# EAGLE design 9volt_rail (EAGLE 7.1.0)
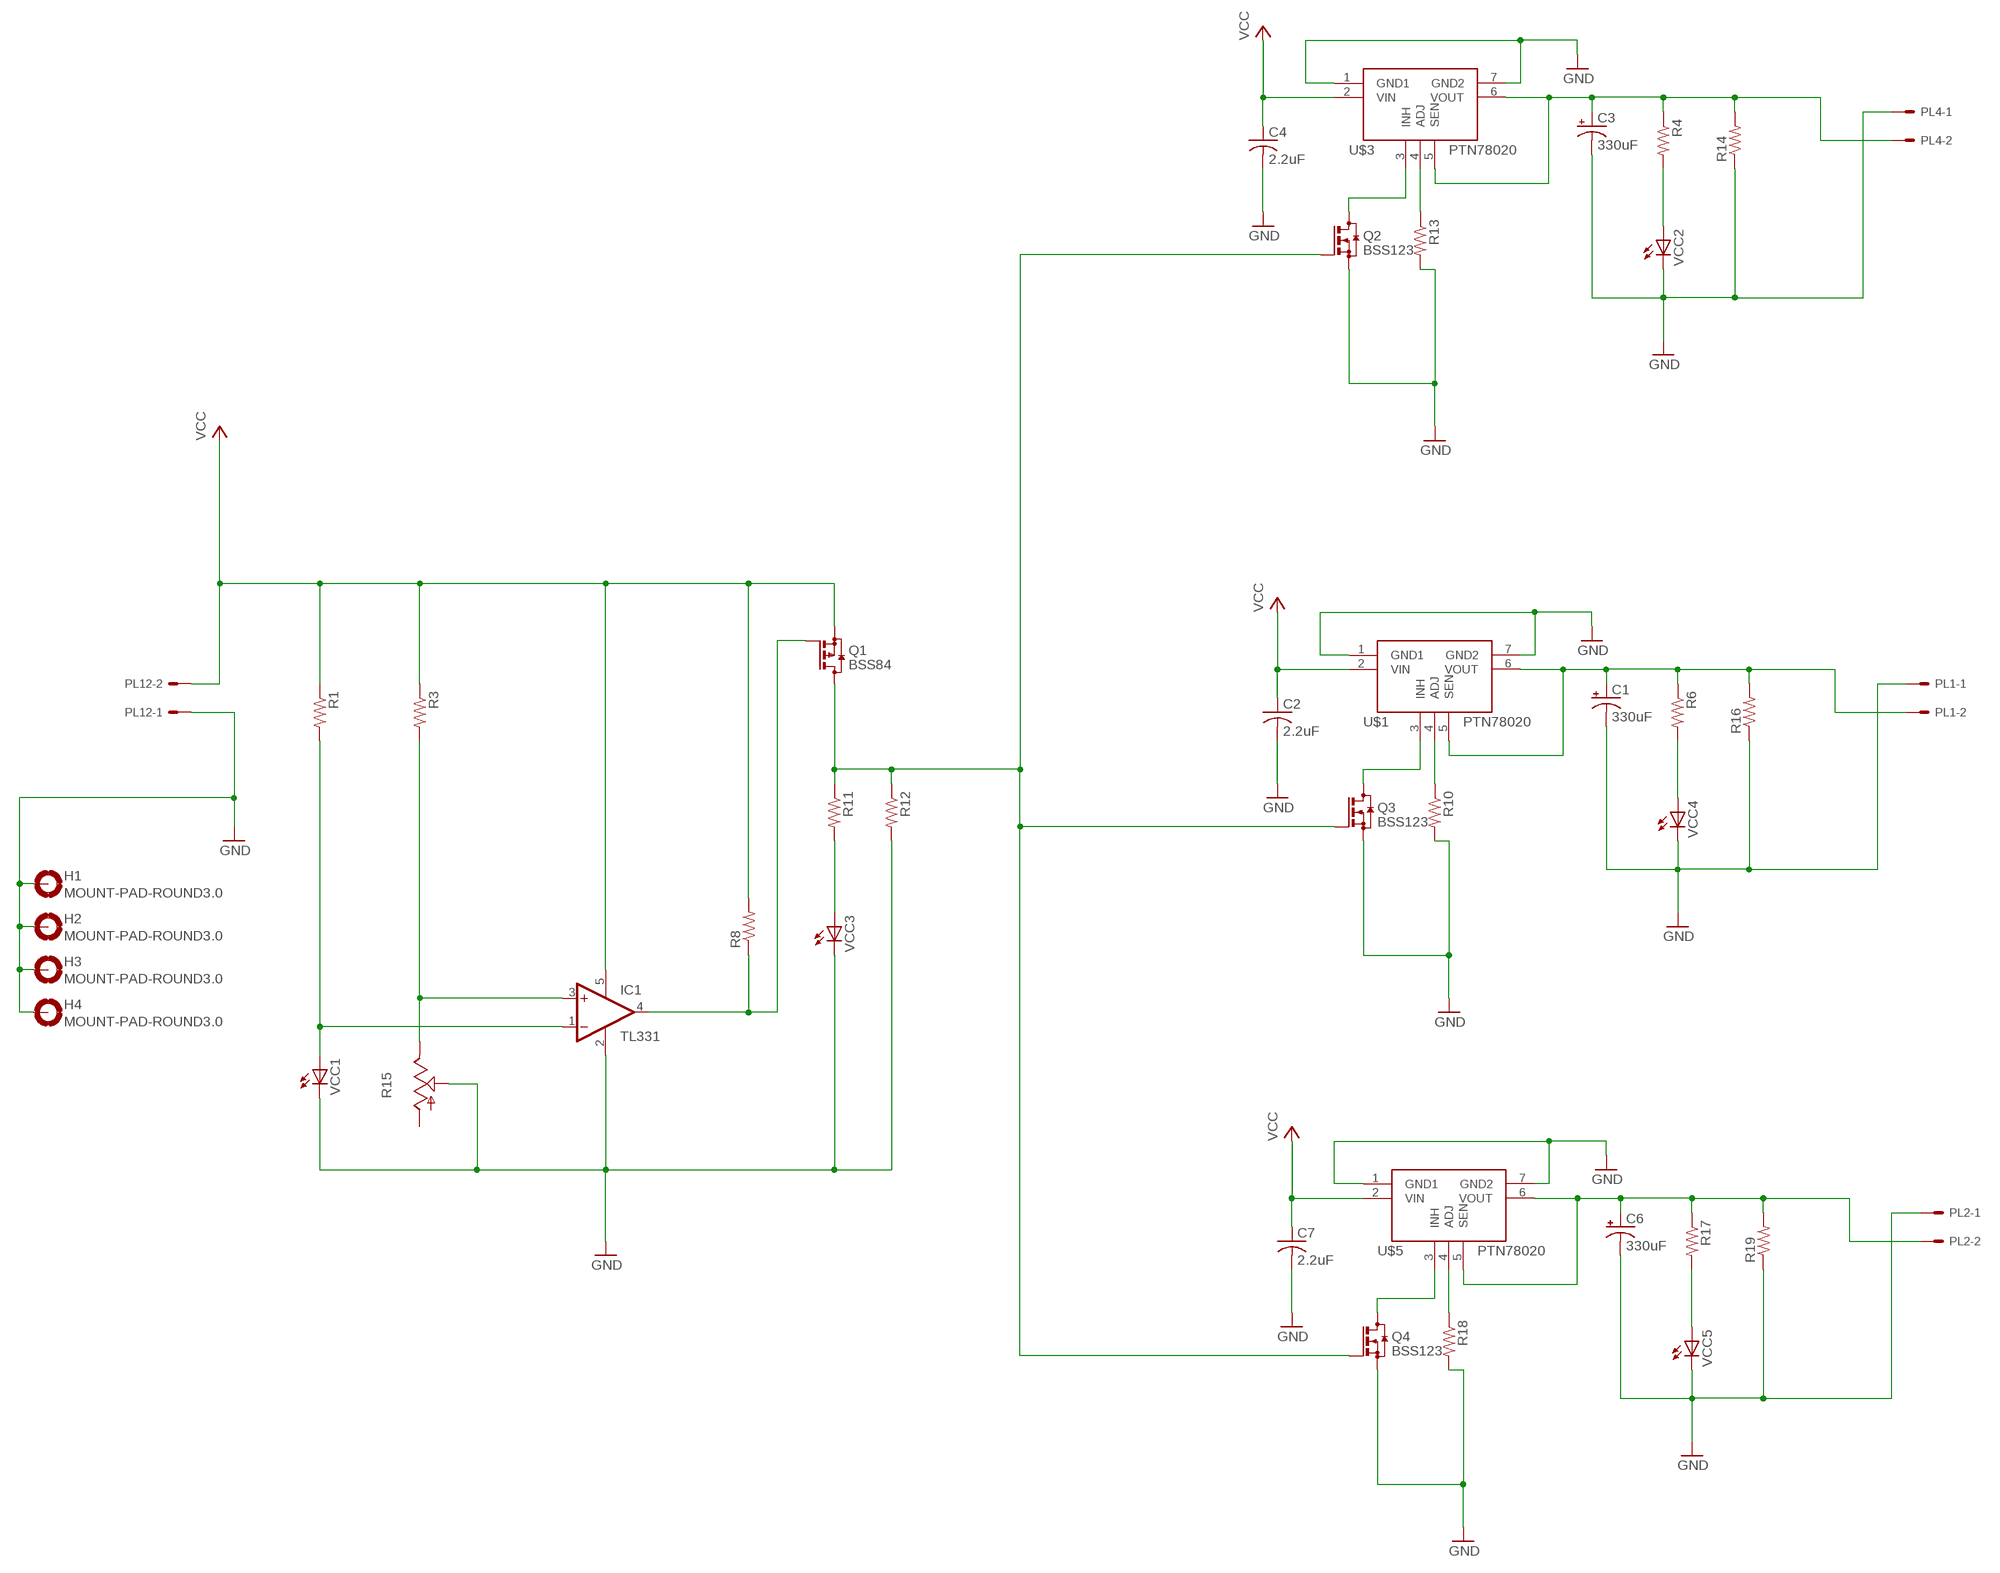
[diagram p0: schematic, sheet 1]

## Parts
C1  330uF  CPOL-USE5-10.5  [E5-10,5]
C2  2.2uF  C-USC0805  [C0805]
C3  330uF  CPOL-USE5-10.5  [E5-10,5]
C4  2.2uF  C-USC0805  [C0805]
C6  330uF  CPOL-USE5-10.5  [E5-10,5]
C7  2.2uF  C-USC0805  [C0805]
H1  MOUNT-PAD-ROUND3.0  [3,0-PAD]
H2  MOUNT-PAD-ROUND3.0  [3,0-PAD]
H3  MOUNT-PAD-ROUND3.0  [3,0-PAD]
H4  MOUNT-PAD-ROUND3.0  [3,0-PAD]
IC1  TL331  [DBV-R-PDSO-G5]
PL1  555X-2H  [5569-2]
PL2  555X-2H  [5569-2]
PL4  555X-2H  [5569-2]
PL12  555X-2H  [5569-2]
Q1  BSS84  [SOT23]
Q2  BSS123  [SOT23]
Q3  BSS123  [SOT23]
Q4  BSS123  [SOT23]
R1  R-US_M0805  [M0805]
R3  R-US_M0805  [M0805]
R4  R-US_M0805  [M0805]
R6  R-US_M0805  [M0805]
R8  R-US_M0805  [M0805]
R10  R-US_M0805  [M0805]
R11  R-US_M0805  [M0805]
R12  R-US_M0805  [M0805]
R13  R-US_M0805  [M0805]
R14  R-US_0617/17  [0617/17]
R15  TRIM_US-S63P  [S63P]
R16  R-US_0617/17  [0617/17]
R17  R-US_M0805  [M0805]
R18  R-US_M0805  [M0805]
R19  R-US_0617/17  [0617/17]
U$1  PTH78020-SMD  [PTN78020-SND]
U$3  PTH78020-SMD  [PTN78020-SND]
U$5  PTH78020-SMD  [PTN78020-SND]
VCC1  LED5MM  [LED5MM]
VCC2  LED5MM  [LED5MM]
VCC3  LED5MM  [LED5MM]
VCC4  LED5MM  [LED5MM]
VCC5  LED5MM  [LED5MM]

## Nets
GND: C1.- C2.2 C3.- C4.2 C6.- C7.2 H1.B3,0(MOUNT) H2.B3,0(MOUNT) H3.B3,0(MOUNT) H4.B3,0(MOUNT) IC1.2(GND) PL1.1 PL2.1 PL4.1 PL12.1 Q2.2(S) Q3.2(S) Q4.2(S) R10.2 R12.2 R13.2 R14.1 R15.S R16.1 R18.2 R19.1 U$1.1(GND1) U$1.7(GND2) U$3.1(GND1) U$3.7(GND2) U$5.1(GND1) U$5.7(GND2) VCC1.K(C) VCC2.K(C) VCC3.K(C) VCC4.K(C) VCC5.K(C)
N$2: IC1.4(OUT) Q1.1(G) R8.1
N$4: IC1.3(+IN) R3.2 R15.E
N$7: IC1.1(-IN) R1.2 VCC1.A
N$8: R11.2 VCC3.A
N$9: R4.2 VCC2.A
N$10: Q2.3(D) U$3.3(INH)
N$11: C3.+ PL4.2 R4.1 R14.2 U$3.5(SEN) U$3.6(VOUT)
N$13: R13.1 U$3.4(ADJ)
N$14: R6.2 VCC4.A
N$15: C1.+ PL1.2 R6.1 R16.2 U$1.5(SEN) U$1.6(VOUT)
N$16: R10.1 U$1.4(ADJ)
N$18: Q3.3(D) U$1.3(INH)
N$19: R17.2 VCC5.A
N$20: C6.+ PL2.2 R17.1 R19.2 U$5.5(SEN) U$5.6(VOUT)
N$21: R18.1 U$5.4(ADJ)
N$23: Q4.3(D) U$5.3(INH)
N$24: Q1.3(D) Q2.1(G) Q3.1(G) Q4.1(G) R11.1 R12.1
VCC: C2.1 C4.1 C7.1 IC1.5(V+) PL12.2 Q1.2(S) R1.1 R3.1 R8.2 U$1.2(VIN) U$3.2(VIN) U$5.2(VIN)
Unconnected: R15.A

## Library data of the parts
C1 C3 C6 = rcl:CPOL-US: POLARIZED CAPACITOR, American symbol
C2 C4 C7 = adafruit:C-US: CAPACITOR, American symbol
H1-H4 = holes:MOUNT-PAD-ROUND: MOUNTING PAD, round
IC1 = linear:TL331: SINGLE DIFFERENTIAL COMPARATOR Source: Data sheet <http://www.ti.com/lit/ds/symlink/tl331-q1.pdf>
PL1 PL2 PL4 PL12 = con-molex-2:555X-2: Mini FIT connector 2 way
Q1 = transistor-small-signal:BSS84: P-CHANNEL MOS FET
Q2-Q4 = transistor-small-signal:BSS123: N-CHANNEL MOS FET
R1 R3 R4 R6 R8 R10-R13 R17 R18 = adafruit:R-US_: RESISTOR, American symbol
R14 R16 R19 = resistor:R-US_: RESISTOR, American symbol
R15 = pot:TRIM_US-: POTENTIOMETER
U$1 U$3 U$5 = PTN78020:PTH78020-SMD
VCC1-VCC5 = adafruit:LED: LED OSRAM: - CHIPLED LG R971, LG N971, LY N971, LG Q971, LY Q971, LO R971, LY R971 LH N974, LH R974 LS Q976, LO Q976, LY Q976 LO Q996 - Hyper CHIPLED LW Q18S LB Q993, LB Q99A, LB R99A - SideLED LS A670, LO A670, LY A670, LG A670, LP A670 LB A673, LV A673, LT A673, LW A673 LH A674 LY A675 LS A676, LA A676, LO A676, LY A676, LW A676 LS A679, LY A679, LG A679 - Hyper Micro SIDELED® LS Y876, LA Y876, LO Y876, LY Y876 LT Y87S - SmartLED LW L88C, LW L88S LB L89C, LB L89S, LG L890 LS L89K, LO L89K, LY L89K LS L896, LA L896, LO L896, LY L896 - TOPLED LS T670, LO T670, LY T670, LG T670, LP T670 LSG T670, LSP T670, LSY T670, LOP T670, LYG T670 LG T671, LOG T671, LSG T671 LB T673, LV T673, LT T673, LW T673 LH T674 LS T676, LA T676, LO T676, LY T676, LB T676, LH T676, LSB T676, LW T676 LB T67C, LV T67C, LT T67C, LS T67K, LO T67K, LY T67K, LW E67C LS E67B, LA E67B, LO E67B, LY E67B, LB E67C, LV E67C, LT E67C LW T67C LS T679, LY T679, LG T679 LS T770, LO T770, LY T770, LG T770, LP T770 LB T773, LV T773, LT T773, LW T773 LH T774 LS E675, LA E675, LY E675, LS T675 LS T776, LA T776, LO T776, LY T776, LB T776 LHGB T686 LT T68C, LB T68C - Hyper Mini TOPLED® LB M676 - Mini TOPLED Santana® LG M470 LS M47K, LO M47K, LY M47K Source: http://www.osram.convergy.de/

## Net classes
0 default: width 0.203 mm, drill 0.508 mm, clearance 0.254 mm

## Board
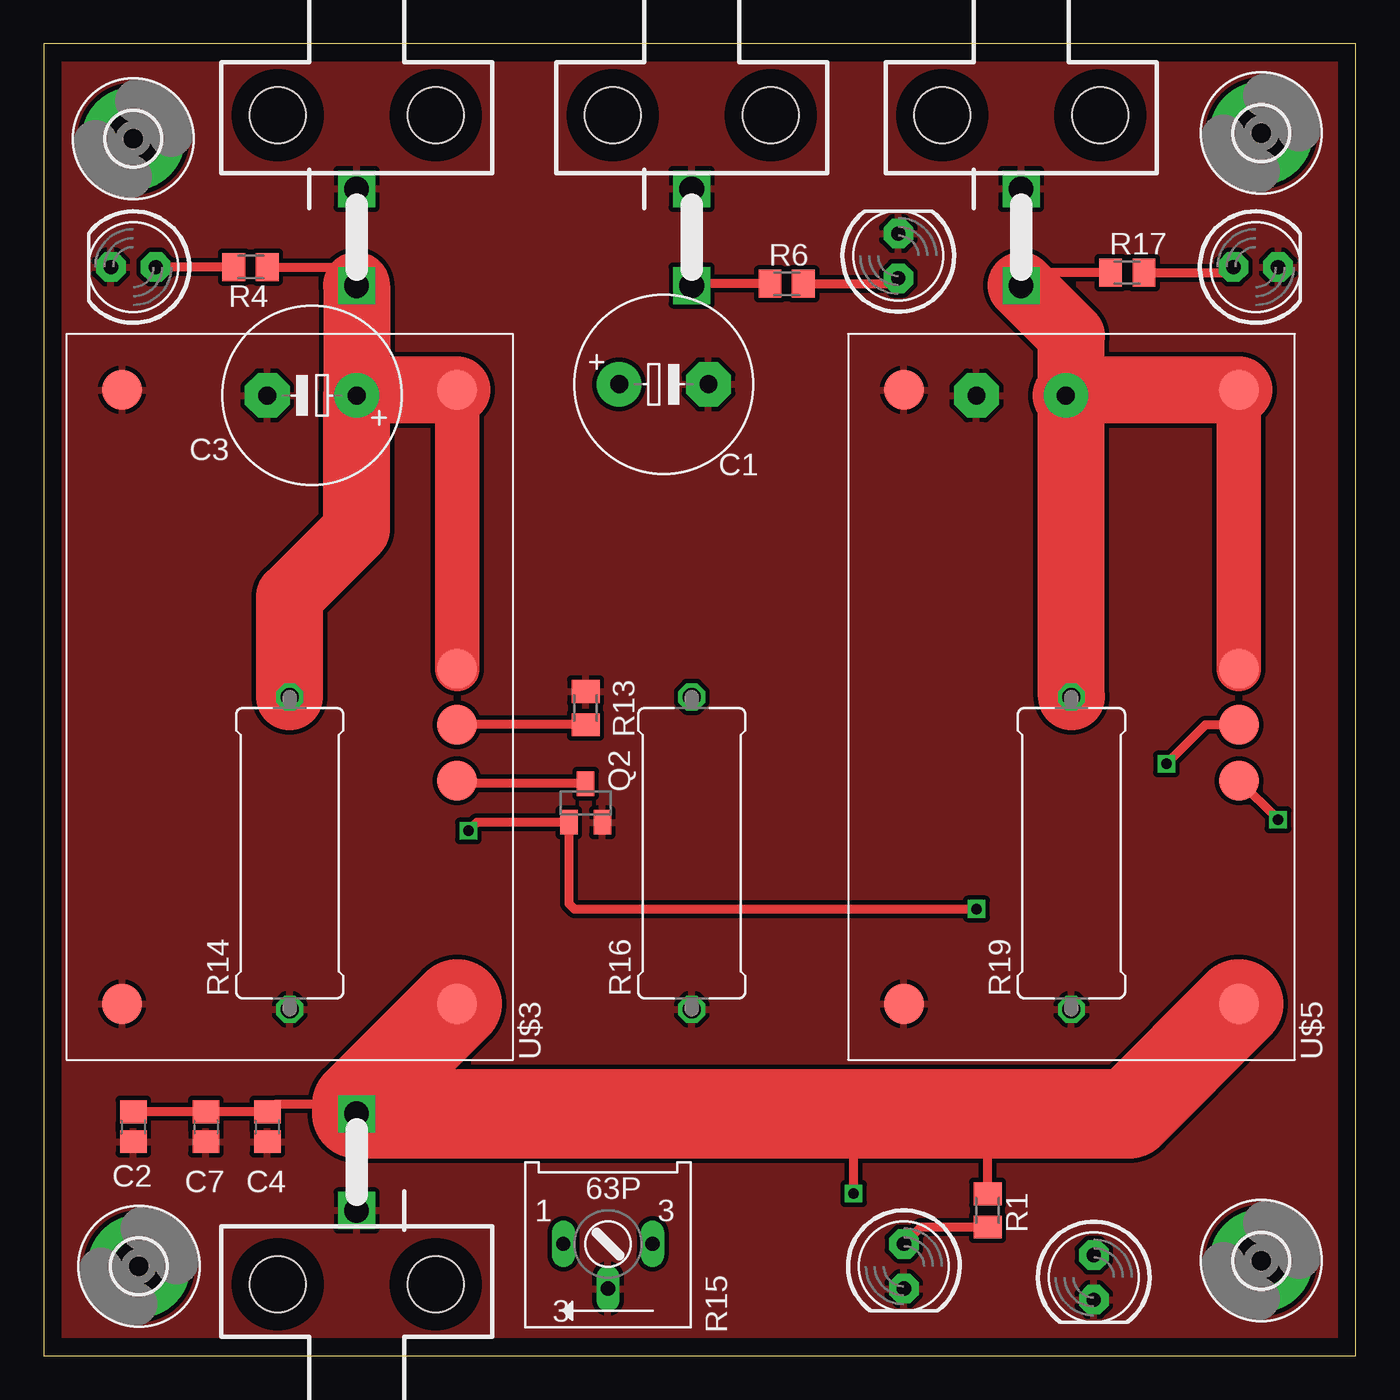
[diagram p1: board, top side]
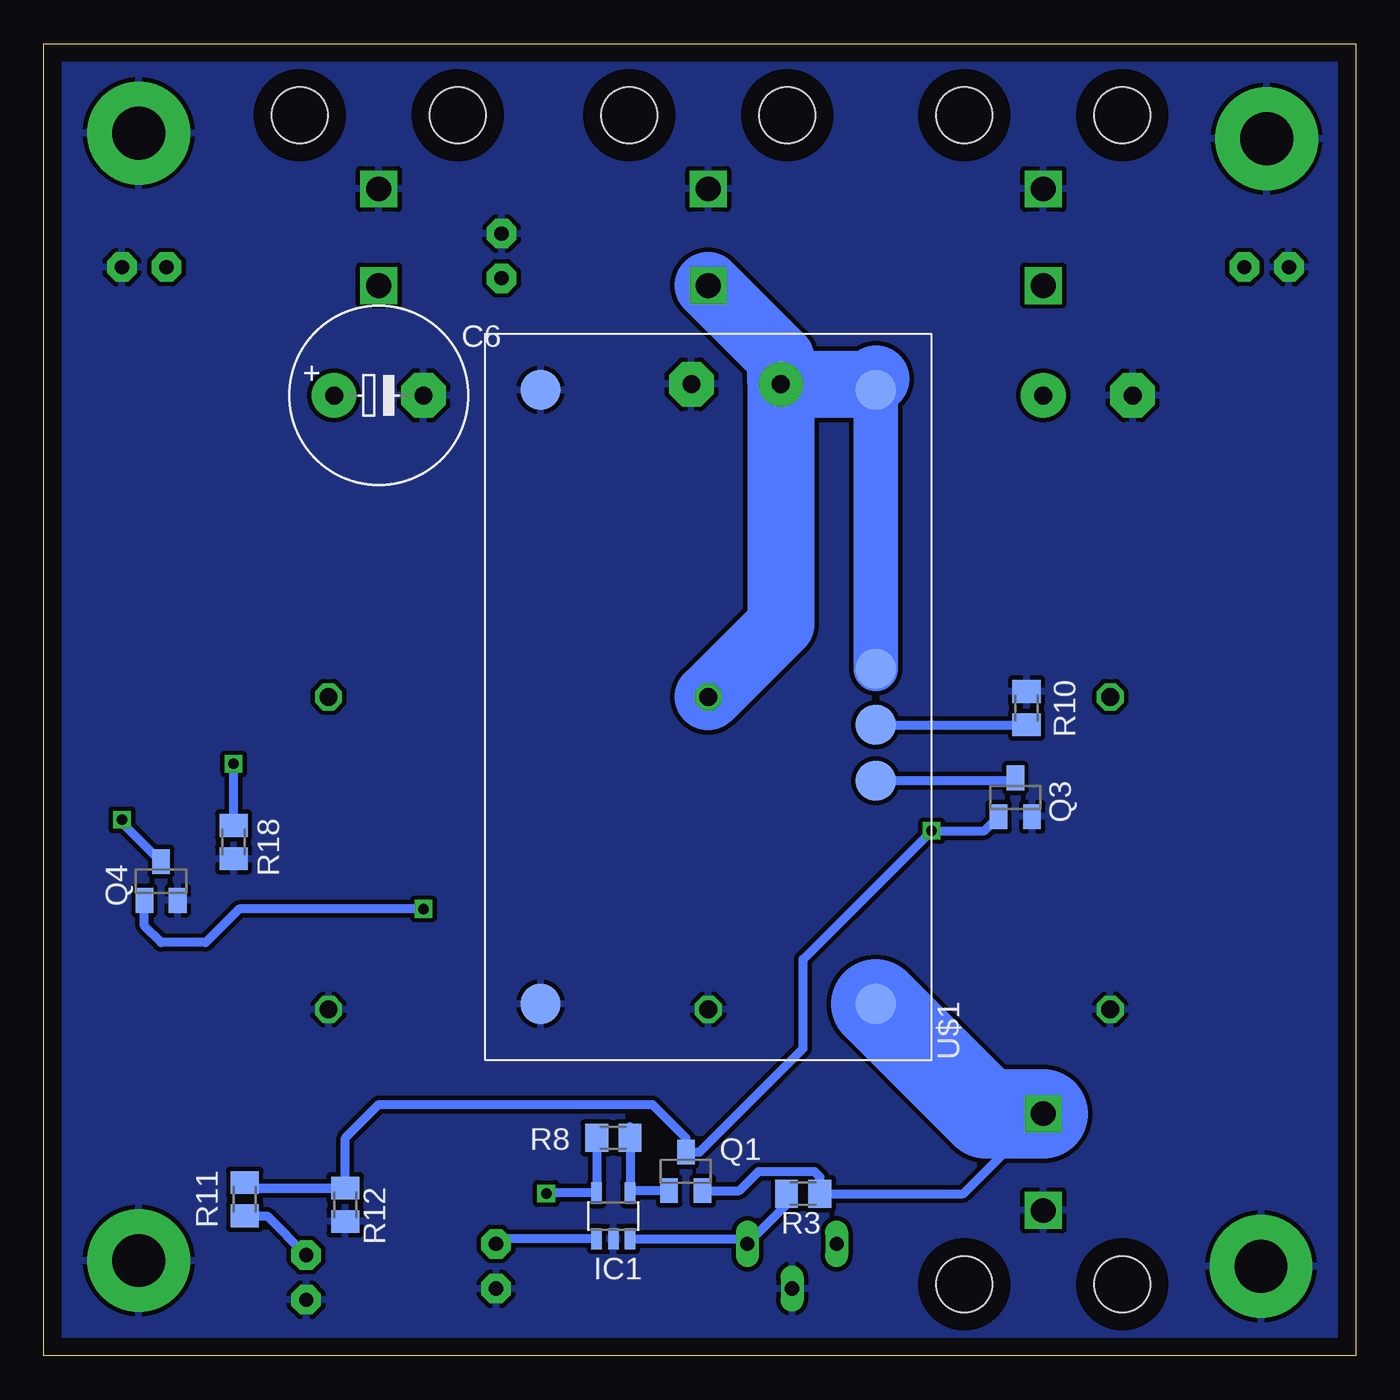
[diagram p2: board, bottom side, seen from below]

Size 74.6 x 74.6 mm. Coordinates in mm from the lower left corner, seen from the top.
Outline: 0,0 74.6,0 74.6,74.6 0,74.6 0,0
Copper layers (1*16): Top 0.035mm / dielectric 1.5mm / Bottom 0.035mm
Design rules "default": minimum track width 10mil, minimum drill 24mil, track to track 8mil, track to pad 8mil, pad to pad 8mil, via to via 8mil, smd to smd 8mil, copper to edge 40mil, drill to drill 8mil, minimum pad ring 10mil, minimum via ring 8mil, stop-mask expansion 4mil, vias tented up to drill 0mil, thermal gap 10mil

### Footprints (pad centres in the part's own frame; a part is rotated, then mirrored left to right if it is on the bottom)
E5-10,5 = drill 1.016 pad 2.54: + -2.54,0 | drill 1.016 pad 2.54 octagon: - 2.54,0
C0805 = smd 1.3 x 1.5: 1 -0.85,0; 2 0.85,0
3,0-PAD = drill 3 pad 5.842: B3,0 0,0
DBV-R-PDSO-G5 = smd 0.6 x 1.2: 1 -0.95,-1.306; 2 0,-1.306; 3 0.95,-1.306; 4 0.95,1.306; 5 -0.95,1.306
5569-2 = drill 1.4 square: 1 0,0; 2 0,5.5 | hole 3.2: 4.5,-4.2; -4.5,-4.2
SOT23 = smd 1 x 1.4: 1 -0.95,-1.1; 2 0.95,-1.1; 3 0,1.1
M0805 = smd 1.3 x 1.6: 1 -0.95,0; 2 0.95,0
0617/17 = drill 1.016 octagon: 1 -8.89,0; 2 8.89,0
S63P = drill 0.813 long: A 2.54,0; E -2.54,0; S 0,2.54
PTN78020-SND = smd 2.286 x 2.286: 1 -17.462,9.525; 2 -17.462,-9.525; 3 -4.763,-9.525; 4 -1.587,-9.525; 5 1.587,-9.525; 6 17.462,-9.525; 7 17.462,9.525
LED5MM = drill 0.813 pad 1.676 octagon: A -1.27,0; K 1.27,0

### Placement (x,y rotation side)
C1  35.24,55.24 0 top
C2  5.08,13.02 270 top
C3  15.24,54.61 180 top
C4  12.7,13.02 270 top
C6  55.56,54.61 0 bottom
C7  9.21,13.02 270 top
H1  69.22,5.4 0 top
H2  69.22,69.53 0 top
H3  5.08,69.22 0 top
H4  5.4,5.08 0 top
IC1  42.23,7.94 0 bottom
PL1  36.83,66.36 180 top
PL2  55.56,66.36 180 top
PL4  17.78,66.36 180 top
PL12  17.78,8.26 0 top
Q1  38.1,10.48 0 bottom
Q2  30.8,31.43 0 top
Q3  19.37,31.75 0 bottom
Q4  67.94,26.99 0 bottom
R1  53.66,8.26 270 top
R3  31.43,9.21 180 bottom
R4  11.75,61.91 180 top
R6  42.23,60.96 0 top
R8  42.23,12.38 180 bottom
R10  18.73,36.83 90 bottom
R11  63.18,8.89 270 bottom
R12  57.47,8.57 270 bottom
R13  30.8,36.83 90 top
R14  13.97,28.58 90 top
R15  32.07,6.35 180 top
R16  36.83,28.58 90 top
R17  61.59,61.59 0 top
R18  63.82,29.21 270 bottom
R19  58.42,28.58 90 top
U$1  36.83,37.46 90 bottom
U$3  13.97,37.46 90 top
U$5  58.42,37.46 90 top
VCC1  48.9,5.08 270 top
VCC2  5.08,61.91 180 top
VCC3  59.69,4.45 270 top
VCC4  48.58,62.55 90 top
VCC5  68.9,61.91 0 top

### Tracks (layer width: path | path; a pad name or v marks a point on that pad's centre or on a via)
GND
  pour Bottom: 0,0.64 74.93,0.64 74.93,80.65 0,80.65
  pour Top: 0,0.64 74.93,0.64 74.93,80.65 0,80.65
N$2
  Bottom 0.508: 41.28,13.02 R8.1 IC1.4 41.14,9.38 Q1.1
N$4
  Bottom 0.508: R3.2 32.38,8.58 R15.E 34.89,6.63 IC1.3
N$7
  Top 0.508: R1.2 49.85,7.3 VCC1.A
  Bottom 0.508: IC1.1 48.61,6.63 VCC1.A
N$8
  Bottom 0.508: R11.2 61.91,7.94 VCC3.A
N$9
  Top 0.508: R4.2 VCC2.A
N$10
  Top 0.508: Q2.3 23.66,32.53 U$3.3
N$11
  Top 0.508: R4.1 16.73,61.91 PL4.2
  Top 1.27: R14.2 13.34,38.1
  Top 2.54: U$3.5 U$3.6
  Top 3.81: U$3.6 18.41,54.93 | 18.41,54.93 C3.+ PL4.2 | R14.2 13.97,43.18 17.78,46.99 17.78,54.29 18.41,54.93
N$13
  Top 0.508: R13.1 U$3.4
N$14
  Top 0.508: R6.2 48.26,60.96 VCC4.A
N$15
  Top 0.508: R6.1 36.93,60.96 PL1.2
  Bottom 2.54: U$1.5 U$1.6 27.3,55.56
  Bottom 3.81: C1.+ 27.62,55.24 27.3,55.56 | C1.+ 32.7,41.59 R16.2 | C1.+ 32.7,56.73 PL1.2
N$16
  Bottom 0.508: U$1.4 R10.1
N$18
  Bottom 0.508: U$1.3 19.52,32.7 Q3.3
N$19
  Top 0.508: R17.2 67.31,61.59 VCC5.A
N$20
  Top 0.508: R17.1 56.3,61.59 PL2.2
  Top 2.54: U$5.5 U$5.6
  Top 3.81: U$5.6 58.42,54.93 | 58.42,54.93 C6.+ 58.42,54.29 R19.2 | 58.42,54.93 58.42,58 PL2.2
N$21  (via drill 0.6)
  Top 0.508: U$5.4 66.04,35.88 63.98,33.81 v63.82,33.66
  Bottom 0.508: R18.1 v63.82,33.66
N$23  (via drill 0.6)
  Top 0.508: U$5.3 v70.17,30.48
  Bottom 0.508: v70.17,30.48 70.17,30.31 Q4.3
N$24  (via drill 0.6)
  Top 0.508: v24.13,29.85 24.62,30.33 Q2.1 29.85,25.71 30.16,25.4 v53.02,25.4
  Bottom 0.508: Q3.1 21.12,29.85 v24.13,29.85 31.43,22.54 31.43,17.46 37.32,11.58 Q1.3 38.1,12.38 40.01,14.29 55.56,14.29 57.47,12.38 R12.1 62.87,9.53 R11.1 62.87,9.52 R12.1 | v53.02,25.4 63.5,25.4 65.41,23.5 67.94,23.5 68.9,24.45 Q4.1
VCC  (via drill 0.6)
  Top 0.508: 17.78,14.29 13.12,14.29 C4.1 C7.1 C2.1 | R1.1 53.66,13.75 | v46.04,9.21 46.04,13.75
  Top 5.08: U$3.2 17.78,14.29 PL12.2 46.04,13.75 53.66,13.75 61.7,13.75 U$5.2
  Bottom 0.508: PL12.2 22.33,9.21 R3.1 30.48,10.16 30.8,10.48 33.97,10.48 35.07,9.38 Q1.2 | v46.04,9.21 46,9.24 IC1.5 R8.2
  Bottom 5.08: U$1.2 21.06,13.75 PL12.2